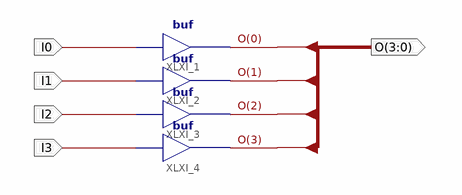
[diagram p0: schematic sheet 1]
// Xilinx ISE schematic wtb4.sch (spartan6) as structural Verilog: 4 symbols, 5 ports
module wtb4 (
  input  I0,
  input  I1,
  input  I2,
  input  I3,
  output [3:0] O
);

  buf XLXI_1 (O[0], I0);
  buf XLXI_2 (O[1], I1);
  buf XLXI_3 (O[2], I2);
  buf XLXI_4 (O[3], I3);
endmodule
